# Altium schematic sheet unit4.SchDoc
size A4
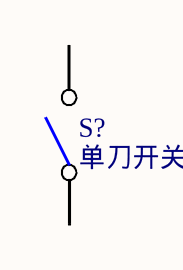
[diagram p0: unit4.SchDoc]

## Parts
S?  单刀开关

## Nets

Not connected (* = marked no-connect by the designer): S? 1 2